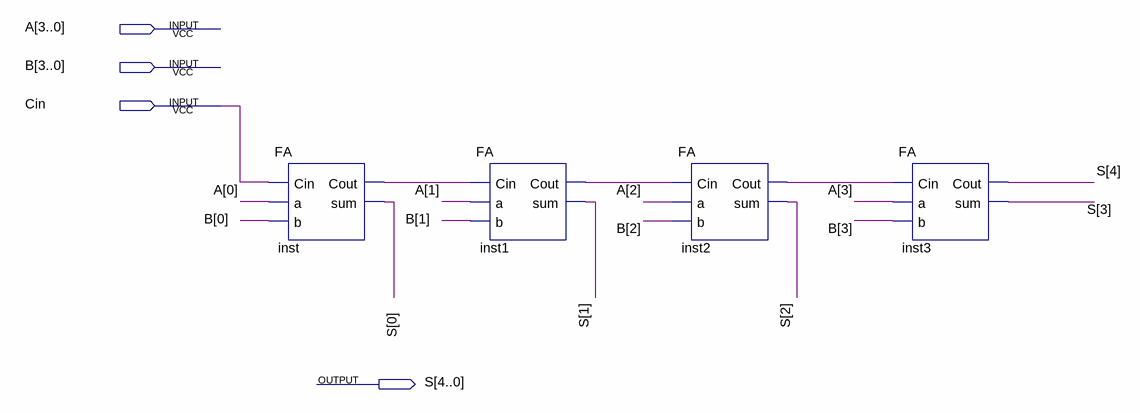
[diagram p0: schematic sheet]
// Quartus schematic 4bitAdder.bdf as structural Verilog: 4 symbols, 4 pins
module \4bitAdder  (
  input  [3:0] A,
  input  [3:0] B,
  input  Cin,
  output [4:0] S
);

  wire inst1_cout, inst2_cout, inst_cout;

  FA inst (.Cin(Cin), .a(A[0]), .b(B[0]), .Cout(inst_cout), .sum(S[0]));
  FA inst1 (.Cin(inst_cout), .a(A[1]), .b(B[1]), .Cout(inst1_cout), .sum(S[1]));
  FA inst2 (.Cin(inst1_cout), .a(A[2]), .b(B[2]), .Cout(inst2_cout), .sum(S[2]));
  FA inst3 (.Cin(inst2_cout), .a(A[3]), .b(B[3]), .Cout(S[4]), .sum(S[3]));
endmodule
